# Altium schematic sheet 02 Index.SchDoc: C200
size 297 x 209 mm; Page Create Date: March  8, 1995; Page Number: 2; Page Size: A4; Comment: radxa_1010; Page Count: 21; RevCode: V1.11; Doc: 02 Index; DsnPath: D:\WMS\C200\CC122\对外\C200 V1.11.DSN; SchematicName: c200; PageName: 02 Index; PageSize: A4; TopSchematic: True
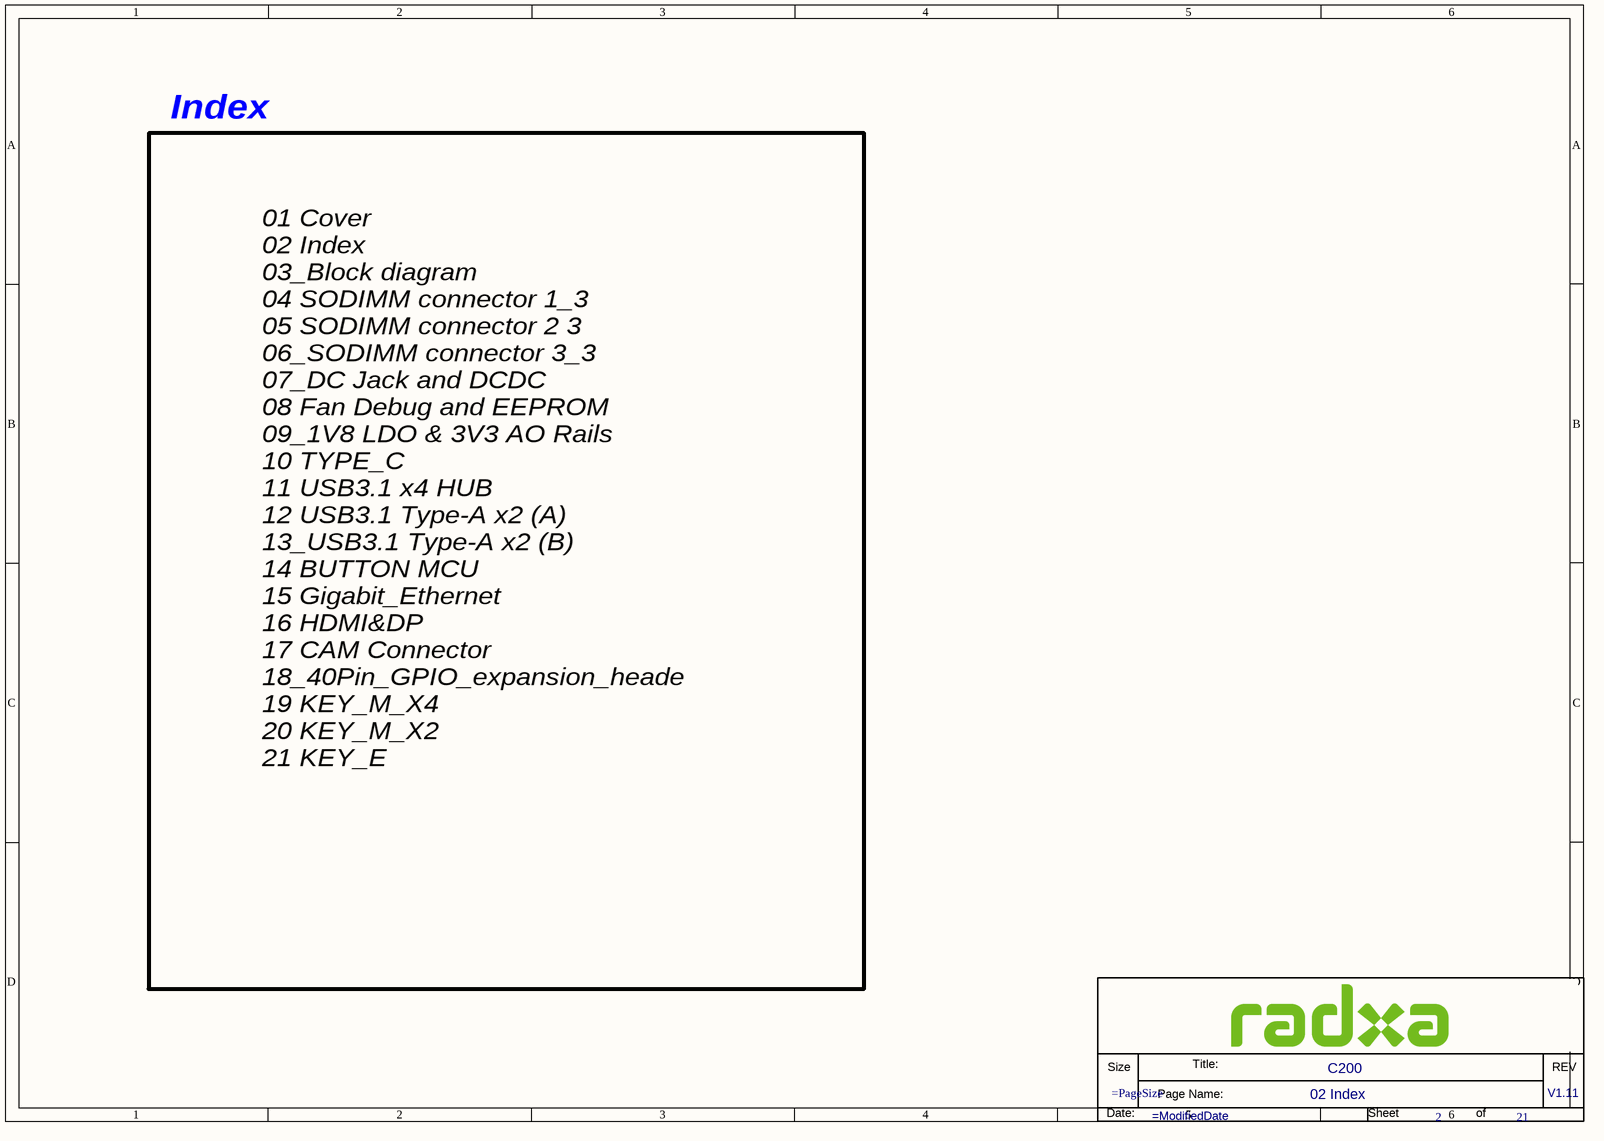
[diagram p0: 02 Index.SchDoc]

## Parts
*  Doc: 02 Index  RevCode: V1.11  Title: C200  Page Number: 2  Page Count: 21  (hidden comment: radxa_1010)  (graphical)

## Notes on the sheet
- Index
- 01 Cover
  02 Index
  03_Block diagram
  04 SODIMM connector 1_3
  05 SODIMM connector 2 3
  06_SODIMM connector 3_3
  07_DC Jack and DCDC
  08 Fan Debug and EEPROM
  09_1V8 LDO & 3V3 AO Rails
  10 TYPE_C
  11 USB3.1 x4 HUB
  12 USB3.1 Type-A x2 (A)
  13_USB3.1 Type-A x2 (B)
  14 BUTTON MCU
  15 Gigabit_Ethernet
  16 HDMI&DP
  17 CAM Connector
  18_40Pin_GPIO_expansion_heade
  19 KEY_M_X4
  20 KEY_M_X2
  21 KEY_E
- (in symbol radxa_1010) Size; Title:; REV; Page Name:; Date:; Sheet; of

## Library data of the parts
* = radxa_1010: Page Create Date: March  8, 1995; Page Size: =PageSize; Page Modify Date: =ModifiedDate